# Altium schematic sheet 103RCT6CORE.SchDoc
size A3
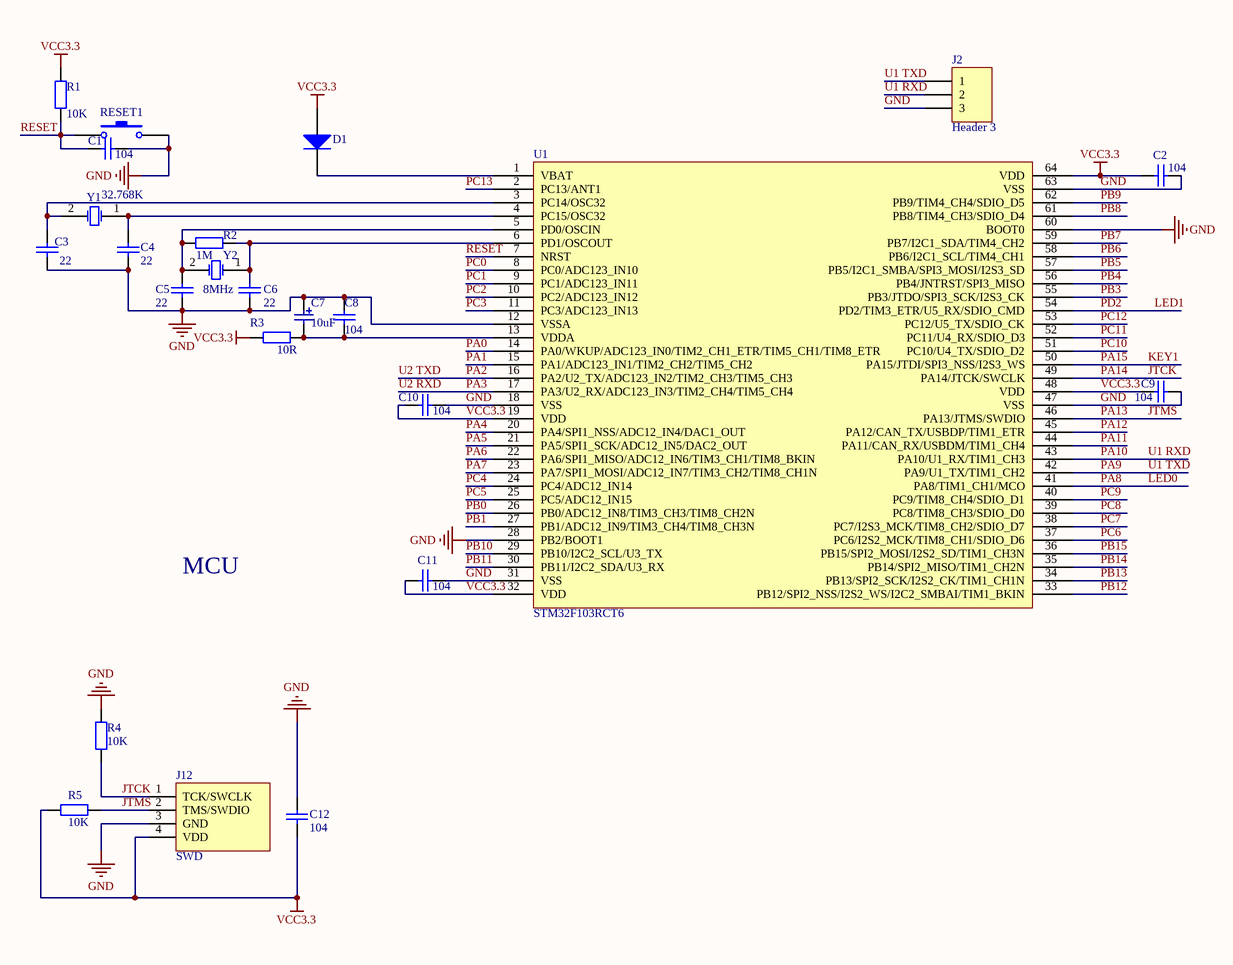
[diagram p0: 103RCT6CORE.SchDoc]

## Parts
C1  value 104  [0805C]  (hidden comment: Cap)
C2  value 104  [0805C]  (hidden comment: Cap)
C3  value 22  [0805C]  (hidden comment: Cap)
C4  value 22  [0805C]  (hidden comment: Cap)
C5  value 22  [0805C]  (hidden comment: Cap)
C6  value 22  [0805C]  (hidden comment: Cap)
C7  10uF  [3216T]
C8  value 104  [0805c]  (hidden comment: Cap)
C9  value 104  [0805C]  (hidden comment: Cap)
C10  value 104  [0805C]  (hidden comment: Cap)
C11  value 104  [0805C]  (hidden comment: Cap)
C12  value 104  [0805C]  (hidden comment: Cap)
D1  Diode 1N914  [1206]  (value not drawn)
J2  Header 3  [HDR1X3]
J12  SWD  [SWD]
R1  value 10K  [0805]  (hidden comment: Res2)
R2  value 1M  [0805]  (hidden comment: Res2)
R3  value 10R  [0805]  (hidden comment: Res2)
R4  value 10K  [0805]  (hidden comment: Res2)
R5  value 10K  [0805]  (hidden comment: Res2)
RESET1  SW-PB  [SWITCH]  (value not drawn)
U1  STM32F103RCT6  [STM32F103RCT6]
Y1  XTAL  [tc-26]  (value not drawn)
Y2  8MHz  [Y2]

## Nets
GND: C1.2 C2.2 C3.1 C4.1 C5.1 C6.2 C7.1 C8.2 C9.2 C10.1 C11.2 C12.1 J2.3 J12.3(GND) R4.1 RESET1.2 U1.12(VSSA) U1.18(VSS) U1.28(PB2/BOOT1) U1.31(VSS) U1.47(VSS) U1.60(BOOT0) U1.63(VSS)
VCC3.3: C2.1 C9.1 C10.2 C11.1 C12.2 D1.1(A) J12.4(VDD) R1.2 R3.2 R5.2 U1.19(VDD) U1.32(VDD) U1.48(VDD) U1.64(VDD)
32.768K: C3.2 U1.3(PC14/OSC32) Y1.2(OSC2)
JTCK: J12.1(TCK/SWCLK) R4.2 U1.49(PA14/JTCK/SWCLK)  [also labelled PA14]
JTMS: J12.2(TMS/SWDIO) R5.1 U1.46(PA13/JTMS/SWDIO)  [also labelled PA13]
KEY1: U1.50(PA15/JTDI/SPI3_NSS/I2S3_WS)  [also labelled PA15]
LED0: U1.41(PA8/TIM1_CH1/MCO)  [also labelled PA8]
LED1: U1.54(PD2/TIM3_ETR/U5_RX/SDIO_CMD)  [also labelled PD2]
PA0: U1.14(PA0/WKUP/ADC123_IN0/TIM2_CH1_ETR/TIM5_CH1/TIM8_ETR)
PA1: U1.15(PA1/ADC123_IN1/TIM2_CH2/TIM5_CH2)
PA2: U1.16(PA2/U2_TX/ADC123_IN2/TIM2_CH3/TIM5_CH3)  [also labelled U2 TXD]
PA3: U1.17(PA3/U2_RX/ADC123_IN3/TIM2_CH4/TIM5_CH4)  [also labelled U2 RXD]
PA4: U1.20(PA4/SPI1_NSS/ADC12_IN4/DAC1_OUT)
PA5: U1.21(PA5/SPI1_SCK/ADC12_IN5/DAC2_OUT)
PA6: U1.22(PA6/SPI1_MISO/ADC12_IN6/TIM3_CH1/TIM8_BKIN)
PA7: U1.23(PA7/SPI1_MOSI/ADC12_IN7/TIM3_CH2/TIM8_CH1N)
PA9: J2.1 U1.42(PA9/U1_TX/TIM1_CH2)  [also labelled U1 TXD]
PA10: J2.2 U1.43(PA10/U1_RX/TIM1_CH3)  [also labelled U1 RXD]
PA11: U1.44(PA11/CAN_RX/USBDM/TIM1_CH4)
PA12: U1.45(PA12/CAN_TX/USBDP/TIM1_ETR)
PB0: U1.26(PB0/ADC12_IN8/TIM3_CH3/TIM8_CH2N)
PB1: U1.27(PB1/ADC12_IN9/TIM3_CH4/TIM8_CH3N)
PB3: U1.55(PB3/JTDO/SPI3_SCK/I2S3_CK)
PB4: U1.56(PB4/JNTRST/SPI3_MISO)
PB5: U1.57(PB5/I2C1_SMBA/SPI3_MOSI/I2S3_SD)
PB6: U1.58(PB6/I2C1_SCL/TIM4_CH1)
PB7: U1.59(PB7/I2C1_SDA/TIM4_CH2)
PB8: U1.61(PB8/TIM4_CH3/SDIO_D4)
PB9: U1.62(PB9/TIM4_CH4/SDIO_D5)
PB10: U1.29(PB10/I2C2_SCL/U3_TX)
PB11: U1.30(PB11/I2C2_SDA/U3_RX)
PB12: U1.33(PB12/SPI2_NSS/I2S2_WS/I2C2_SMBAI/TIM1_BKIN)
PB13: U1.34(PB13/SPI2_SCK/I2S2_CK/TIM1_CH1N)
PB14: U1.35(PB14/SPI2_MISO/TIM1_CH2N)
PB15: U1.36(PB15/SPI2_MOSI/I2S2_SD/TIM1_CH3N)
PC0: U1.8(PC0/ADC123_IN10)
PC1: U1.9(PC1/ADC123_IN11)
PC2: U1.10(PC2/ADC123_IN12)
PC3: U1.11(PC3/ADC123_IN13)
PC4: U1.24(PC4/ADC12_IN14)
PC5: U1.25(PC5/ADC12_IN15)
PC6: U1.37(PC6/I2S2_MCK/TIM8_CH1/SDIO_D6)
PC7: U1.38(PC7/I2S3_MCK/TIM8_CH2/SDIO_D7)
PC8: U1.39(PC8/TIM8_CH3/SDIO_D0)
PC9: U1.40(PC9/TIM8_CH4/SDIO_D1)
PC10: U1.51(PC10/U4_TX/SDIO_D2)
PC11: U1.52(PC11/U4_RX/SDIO_D3)
PC12: U1.53(PC12/U5_TX/SDIO_CK)
PC13: U1.2(PC13/ANT1)
RESET: C1.1 R1.1 RESET1.1 U1.7(NRST)
NetC4_2: C4.2 U1.4(PC15/OSC32) Y1.1(OSC1)
NetC5_2: C5.2 R2.2 U1.5(PD0/OSCIN) Y2.2(OSC2)
NetC6_1: C6.1 R2.1 U1.6(PD1/OSCOUT) Y2.1(OSC1)
NetC7_2: C7.2 C8.1 R3.1 U1.13(VDDA)
NetD1_2: D1.2(K) U1.1(VBAT)

## Notes on the sheet
- Labels drawn without touching a wire or pin: MCU

## Library data of the parts
C1-C6 C8-C12 = Cap: Capacitor; Published: 8-Jun-2000; LatestRevisionDate: 17-Jul-2002; LatestRevisionNote: Re-released for DXP Platform.; PackageReference: RAD-0.3; Publisher: Altium Limited; PackageDescription: Radial Cap, Thru-Hole; 2 Leads; 0.3 in Pin Spacing
C7 = CAP-POL1
D1 = Diode 1N914: High Conductance Fast Diode; Published: 8-Jun-2000; LatestRevisionDate: 17-Jul-2002; LatestRevisionNote: Re-released for DXP Platform.; DatasheetVersion: 1997; PackageReference: DO-35; Publisher: Altium Limited; PackageDescription: Diode, Axial; Body 3.8 x 1.9 mm (LxDia. max), Lead Dia. 0.53 mm (max); Code_JEDEC: DO-204-AH; ComponentLink1Description: Manufacturer Link; ComponentLink1URL: http://www.fairchildsemi.com/; ComponentLink2Description: Datasheet; ComponentLink2URL: http://www.fairchildsemi.com/ds/1N%2F1N4448.pdf
J2 = Header 3: Header, 3-Pin; LatestRevisionDate: 17-Jul-2002; LatestRevisionNote: Re-released for DXP Platform.; Publisher: Altium Limited
R1-R5 = Res2: Resistor; Published: 8-Jun-2000; LatestRevisionDate: 17-Jul-2002; LatestRevisionNote: Re-released for DXP Platform.; PackageReference: AXIAL-0.4; Publisher: Altium Limited; PackageDescription: Axial Device, Thru-Hole; 2 Leads; 0.4 in Pin Spacing
RESET1 = SW-PB: Switch; Published: 24-Mar-1999; LatestRevisionDate: 17-Jul-2002; LatestRevisionNote: Re-released for DXP Platform.; PackageReference: SPST-2; Publisher: Altium Limited; PackageDescription: Switch; 2 Leads
Y1 Y2 = XTAL: Crystal Oscillator; Published: 8-Jun-2000; LatestRevisionDate: 17-Jul-2002; LatestRevisionNote: Re-released for DXP Platform.; PackageReference: R38; Publisher: Altium Limited; PackageDescription: Crystal, Thru-Hole; 2 Leads; Body 3.1 x 8.2 mm (Dia.xH)